# EAGLE design ICS40300-Silicon-Mic_Rev-A2 (EAGLE 8.0.0)
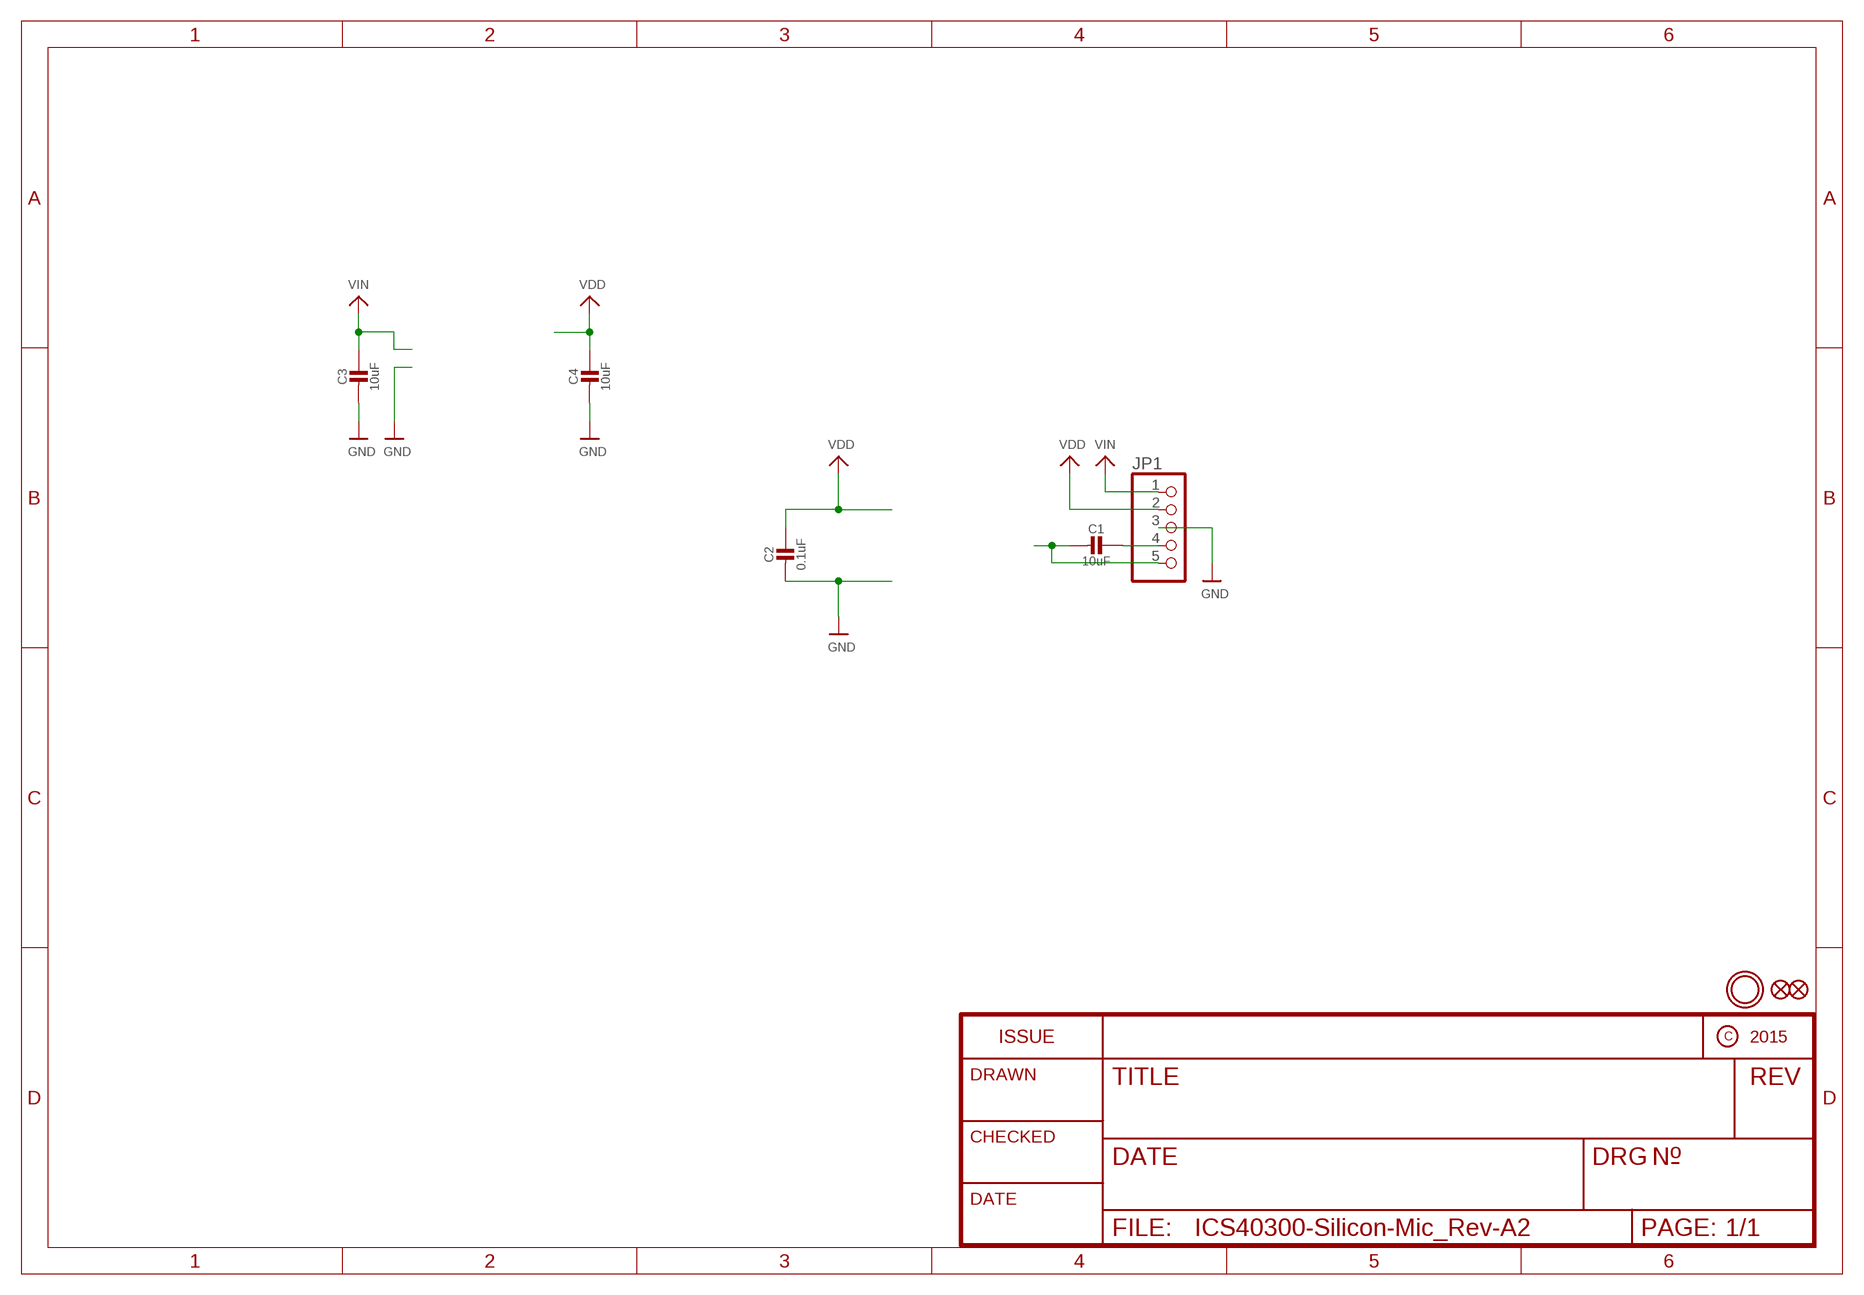
[diagram p0: schematic, sheet 1]

## Parts
C1  10uF  CAP_CERAMIC0805-NOOUTLINE  [0805-NO]
C2  0.1uF  CAP_CERAMIC0805-NOOUTLINE  [0805-NO]
C3  10uF  CAP_CERAMIC0805-NOOUTLINE  [0805-NO]
C4  10uF  CAP_CERAMIC0805-NOOUTLINE  [0805-NO]
FID1  FIDUCIAL""  [FIDUCIAL_1MM]
FID2  FIDUCIAL""  [FIDUCIAL_1MM]
JP1  HEADER-1X576MIL  [1X05_ROUND_76]
U$12  MOUNTINGHOLE2.5  [MOUNTINGHOLE_2.5_PLATED]

## Nets
GND: C2.2 C3.2 C4.2 JP1.3
N$1: C1.2 JP1.5
N$2: C1.1 JP1.4
VDD: C2.1 C4.1 JP1.2
VIN: C3.1 JP1.1

## Library data of the parts
C1-C4 = microbuilder:CAP_CERAMIC: Ceramic Capacitors For new designs, use the packages preceded by an '_' character since they are more reliable: The following footprints should be used on most boards: _0402 - Standard footprint for regular board layouts _0603 - Standard footprint for regular board layouts _0805 - Standard footprint for regular board layouts _1206 - Standard footprint for regular board layouts For extremely tight-pitch boards where space is at a premium, the following 'micro-pitch' footprints can be used (smaller pads, no silkscreen outline, etc.): _0402MP - Micro-pitch footprint for very dense/compact boards _0603MP - Micro-pitch footprint for very dense/compact boards _0805MP - Micro-pitch footprint for very dense/compact boards _1206MP - Micro-pitch footprint for very dense/compact boards
FID1 FID2 = microbuilder:FIDUCIAL: Fiducial Alignment Points Various fiducial points for machine vision alignment.; BOM: EXCLUDE
JP1 = microbuilder:HEADER-1X5: PIN HEADER
U$12 = microbuilder:MOUNTINGHOLE: Mounting Hole For #2 screws (0.086"/2.18mm width, 0.094"/2.4mm hole) use 2.5mm; BOM: EXCLUDE

## Board
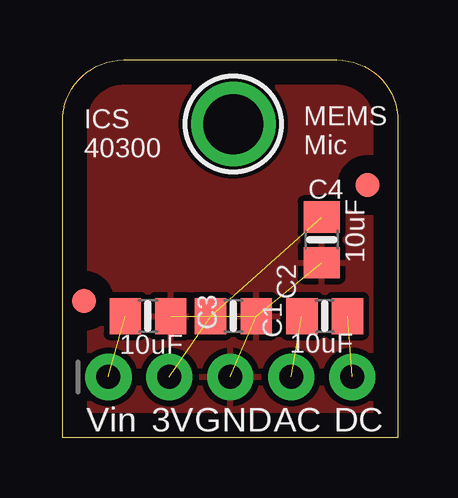
[diagram p1: board, top side]
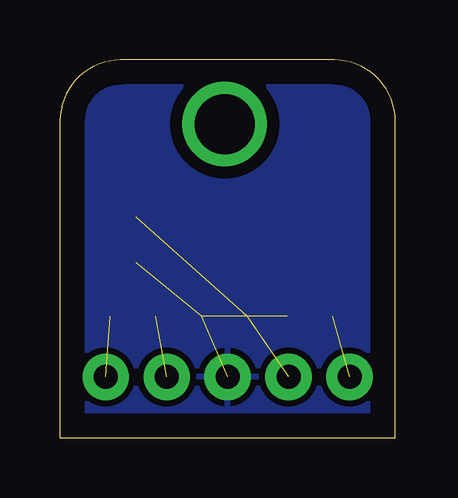
[diagram p2: board, bottom side, seen from below]

Size 13.97 x 15.75 mm. Coordinates in mm from the lower left corner, seen from the top.
Outline: 0,0 0,13.21 arc-90 2.54,15.75 11.43,15.75 arc-90 13.97,13.21 13.97,0 0,0
Copper layers (1*16): Top 0.035mm / dielectric 1.5mm / Bottom 0.035mm
Design rules "default": minimum track width 10mil, minimum drill 24mil, track to track 8mil, track to pad 8mil, pad to pad 8mil, via to via 8mil, smd to smd 8mil, copper to edge 40mil, drill to drill 8mil, minimum pad ring 10mil, minimum via ring 8mil, stop-mask expansion 4mil, vias tented up to drill 0mil, thermal gap 10mil

### Footprints (pad centres in the part's own frame; a part is rotated, then mirrored left to right if it is on the bottom)
0805-NO = smd 1.3 x 1.5: 1 -0.95,0; 2 0.95,0
FIDUCIAL_1MM = smd 1 x 1: 1 0,0
1X05_ROUND_76 = drill 1 pad 1.93: 1 -5.08,0; 2 -2.54,0; 3 0,0; 4 2.54,0; 5 5.08,0
MOUNTINGHOLE_2.5_PLATED = drill 2.5 pad 3.2: P$1 0,0

### Placement (x,y rotation side)
C1  10.92,5.08 0 top
C2  7.11,5.08 0 top
C3  3.56,5.08 0 top
C4  10.79,8.26 270 top
FID1  0.89,5.71 0 top
FID2  12.7,10.54 0 top
JP1  6.99,2.54 0 top
U$12  7.11,13.08 0 top

### Tracks (layer width: path | path; a pad name or v marks a point on that pad's centre or on a via)
GND  (3 unrouted)
  pour Top (isolate 0.254): 0,0 0,15.88 13.97,15.88 13.97,0
  pour Bottom (isolate 0.254): 0,0.25 0,15.88 13.97,15.88 13.97,0
N$1  (1 unrouted)
N$2  (1 unrouted)
VDD  (2 unrouted)
VIN  (1 unrouted)

### Text on the board
tPlace: ICS / 40300 | MEMS / Mic | Vin | 3V | GND | AC | DC